# Altium schematic sheet ADCAMP_AD8330.SchDoc
size A3; DocumentNumber: 1; SheetNumber: 1; SheetTotal: 5
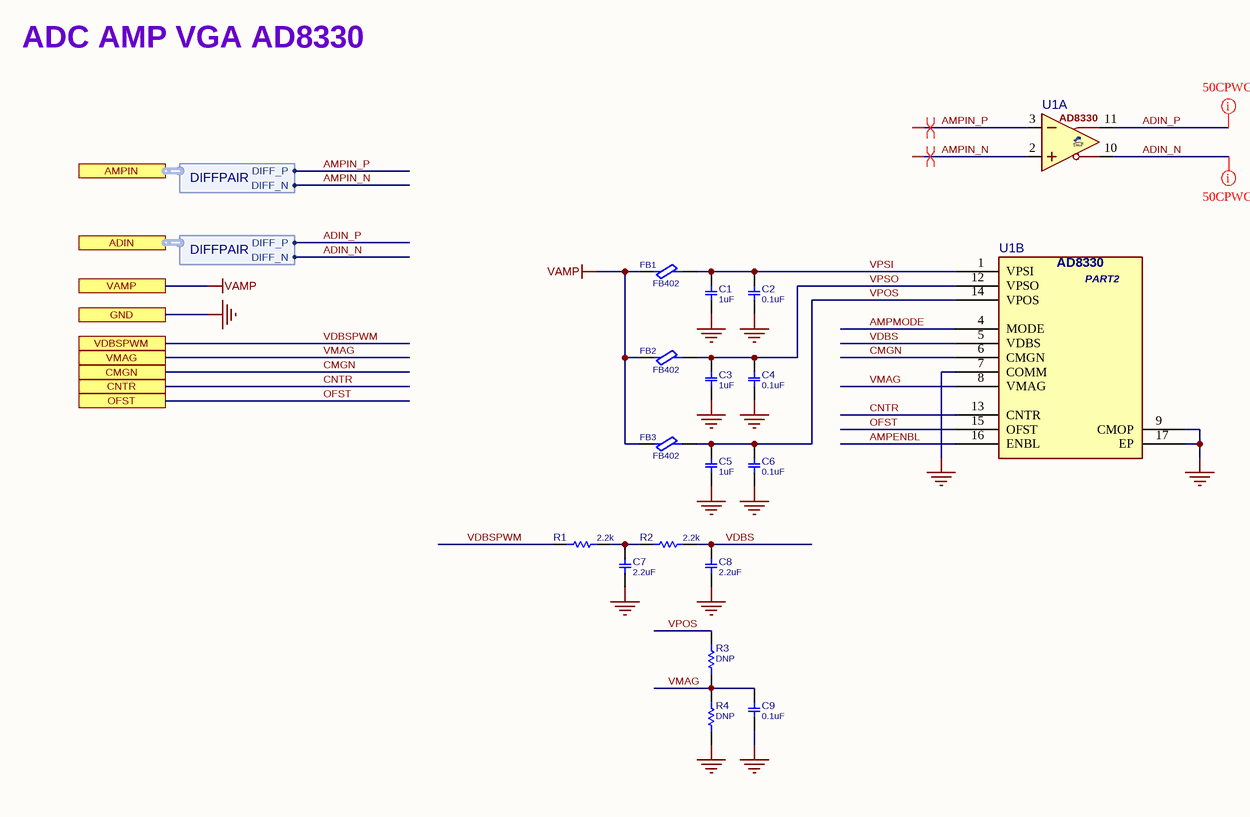
[diagram p0: ADCAMP_AD8330.SchDoc]

## Parts
C1  1uF  [C0402]
C2  0.1uF  [C0402]
C3  1uF  [C0402]
C4  0.1uF  [C0402]
C5  1uF  [C0402]
C6  0.1uF  [C0402]
C7  2.2uF  [C0402]
C8  2.2uF  [C0402]
C9  0.1uF  [C0402]
FB1  FB402  [L0402]
FB2  FB402  [L0402]
FB3  FB402  [L0402]
R1  2.2k  [R0402]
R2  2.2k  [R0402]
R3  DNP  [R0402]
R4  DNP  [R0402]
U1  AD8330  [QFN50_16T_3X3]  (value not drawn)  (parts A,B of 2)

## Ports
ADIN (harness DIFFPAIR), AMPIN (harness DIFFPAIR), CMGN, CNTR, GND, OFST, VAMP, VDBSPWM, VMAG

## Harnesses
DIFFPAIR: DIFF_N, DIFF_P

## Nets
GND: C1.2 C2.2 C3.2 C4.2 C5.2 C6.2 C7.2 C8.2 C9.2 R4.1 U1.7(COMM) U1.9(CMOP) U1.17(EP) ; port GND
VAMP: FB1.1 FB2.1 FB3.1 ; port VAMP
ADIN_N: U1.10(OPLO) ; port ADIN.DIFF_N
ADIN_P: U1.11(OPHI) ; port ADIN.DIFF_P
AMPENBL: U1.16(ENBL)
AMPIN_N: U1.2(INHI) ; port AMPIN.DIFF_N
AMPIN_P: U1.3(INLO) ; port AMPIN.DIFF_P
AMPMODE: U1.4(MODE)
CMGN: U1.6(CMGN) ; port CMGN
CNTR: U1.13(CNTR) ; port CNTR
OFST: U1.15(OFST) ; port OFST
VDBS: C8.1 R2.2 U1.5(VDBS)
VDBSPWM: R1.1 ; port VDBSPWM
VMAG: C9.1 R3.1 R4.2 U1.8(VMAG) ; port VMAG
VPOS: C5.1 C6.1 FB3.2 R3.2 U1.14(VPOS)
VPSI: C1.1 C2.1 FB1.2 U1.1(VPSI)
VPSO: C3.1 C4.1 FB2.2 U1.12(VPSO)
NetC7_1: C7.1 R1.2 R2.1

## Layout directives
differential pair: AMPIN_N, AMPIN_P
net class Imp50CPWG: ADIN_N, ADIN_P

## Notes on the sheet
- ADC AMP VGA AD8330
- (in symbol AD8330_QFN16, part B) PART2

## Library data of the parts
C1 C3 C5 C7 C8 = CAP_SMD_MLCC_100n50T: CAP, MLCC; PARAM: 25V; PARAM2: X5R, 10%; MANF_P#: -; MANF: -; DESC: -; ASSEMBLY: ASSEMBLY; PRICE: 100= 5$
  C1 C3 C5: VALUE: 1uF
  C7 C8: VALUE: 2.2uF
C2 C4 C6 C9 = CAP_SMD_MLCC_100n50T: CAP, MLCC; PARAM: 50V; PARAM2: X5R, 10%; MANF_P#: -; MANF: -; DESC: -; ASSEMBLY: ASSEMBLY; PRICE: 100= 5$; VALUE: 0.1uF
FB1-FB3 = FBEAD_SMD_BLM15PD121: FERRITE_Bead, 0402, 0.5A, 200mOhm, 120@100MHz; MANF: MURATA; MANF_P#: BLM15AG121SN1D; PARAM: 120@100MHz; PARAM2: 0.5A, 200mOhm; VALUE: FB402
R1-R4 = RES_SMD_10K_0402: RESISTOR, SMD; MANF: Yageo; PARAM: 0.063W; DESC: DESCRIPTION; DIST#: MOUSER; PARAM2: 1%; ASSEMBLY: ASSEMBLY; PRICE: 100= 0.3$; MANF_P#: -
  R1 R2: VALUE: 2.2k
  R3 R4: VALUE: DNP
U1 = AD8330_QFN16: AMP, Differential, Hi-Sp, Fully-Diff, VGA; MANF: Analog Devices; PARAM: 150MHz BW; PARAM2: 2.7~6V; MANF_P#: AD8330ACPZ; VALUE: AD8330